# Altium schematic sheet [09] - PERIPHERALS D.SchDoc: Test title
size A4; Date: YYYY-MM-DD; Engineer: X; SheetNumber: 9; Size: A4
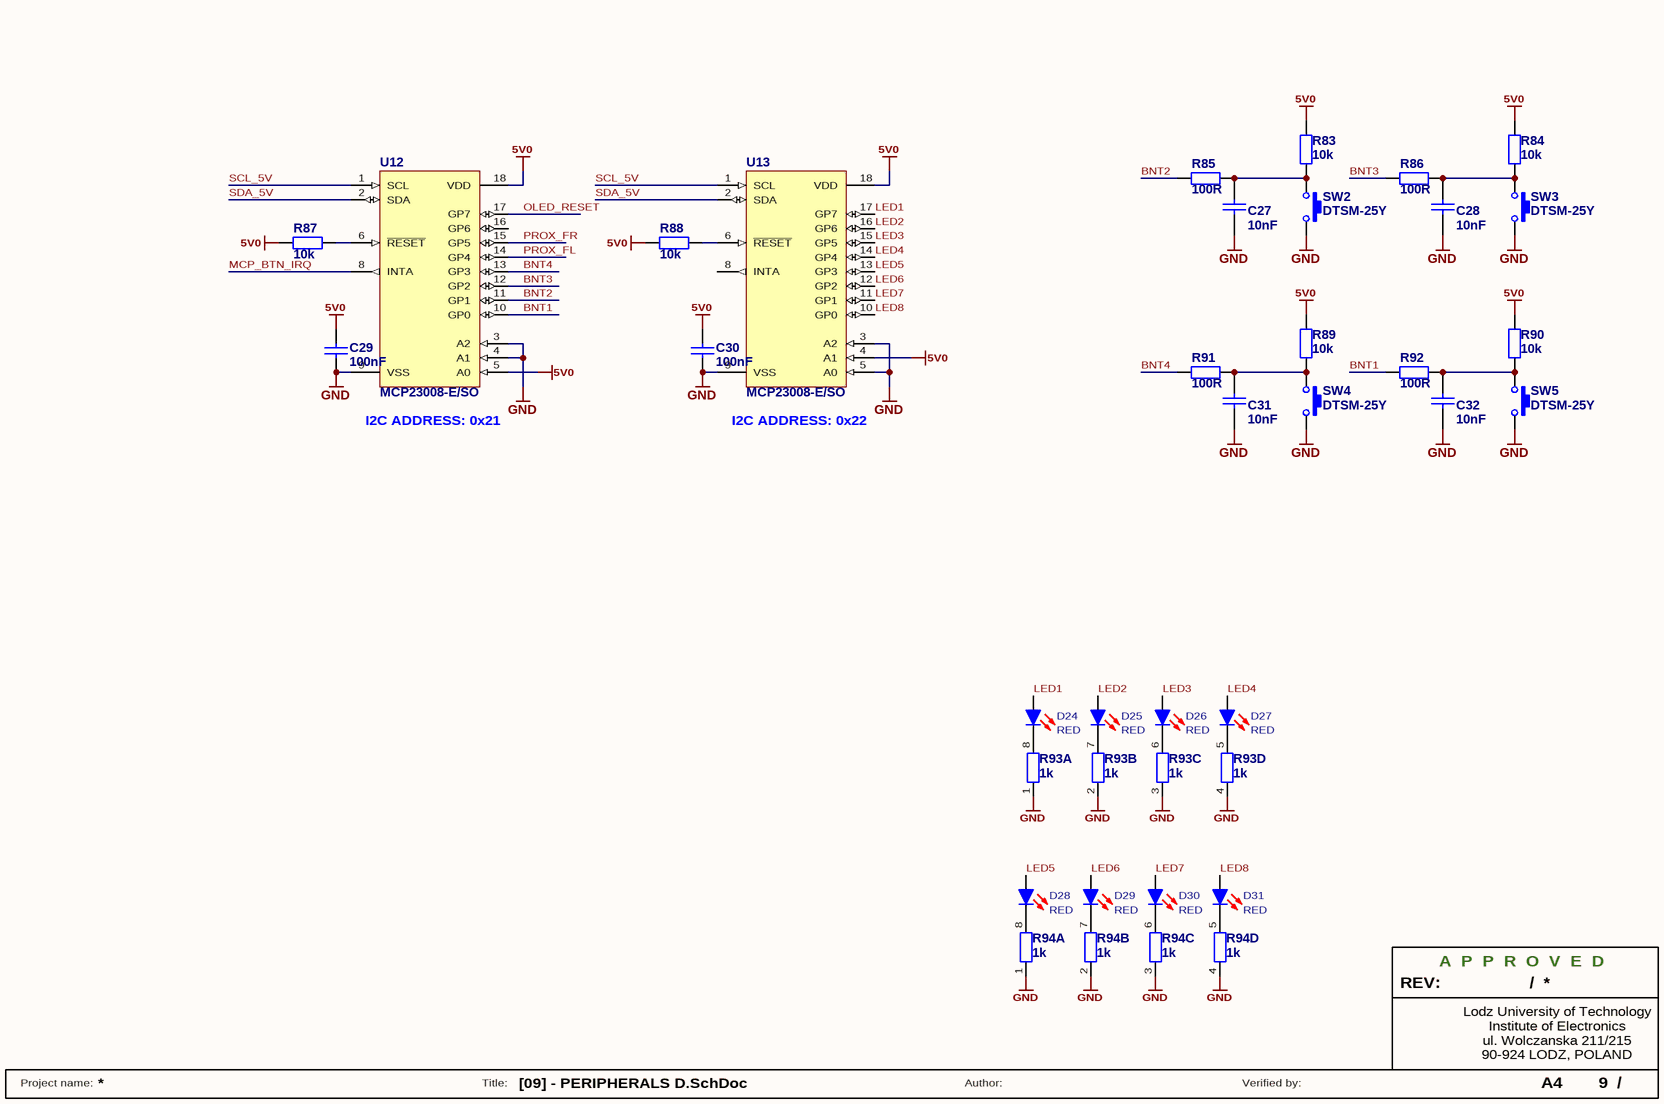
[diagram p0: [09] - PERIPHERALS D.SchDoc]

## Parts
C27  10nF  [C0805]
C28  10nF  [C0805]
C29  100nF  [C0805]
C30  100nF  [C0805]
C31  10nF  [C0805]
C32  10nF  [C0805]
D24  RED  [LED0805R]
D25  RED  [LED0805R]
D26  RED  [LED0805R]
D27  RED  [LED0805R]
D28  RED  [LED0805R]
D29  RED  [LED0805R]
D30  RED  [LED0805R]
D31  RED  [LED0805R]
R83  10k  [R0805]
R84  10k  [R0805]
R85  100R  [R0805]
R86  100R  [R0805]
R87  10k  [R0805]
R88  10k  [R0805]
R89  10k  [R0805]
R90  10k  [R0805]
R91  100R  [R0805]
R92  100R  [R0805]
R93  1k  [RPack_0603x4_1206]  (parts A,B,C,D of 4)
R94  1k  [RPack_0603x4_1206]  (parts A,B,C,D of 4)
SW2  DTSM-25Y  [DTSM-25Y]
SW3  DTSM-25Y  [DTSM-25Y]
SW4  DTSM-25Y  [DTSM-25Y]
SW5  DTSM-25Y  [DTSM-25Y]
U12  MCP23008-E/SO  [SO18W]
U13  MCP23008-E/SO  [SO18W]

## Nets
5V0: C29.2 C30.2 R83.2 R84.2 R87.1 R88.1 R89.2 R90.2 U12.5(A0) U12.18(VDD) U13.4(A1) U13.18(VDD)
GND: C27.1 C28.1 C29.1 C30.1 C31.1 C32.1 R93.1 R93.2 R93.3 R93.4 R94.1 R94.2 R94.3 R94.4 SW2.2 SW3.2 SW4.2 SW5.2 U12.3(A2) U12.4(A1) U12.9(VSS) U13.3(A2) U13.5(A0) U13.9(VSS)
BNT1: R92.1 U12.10(GP0)
BNT2: R85.1 U12.11(GP1)
BNT3: R86.1 U12.12(GP2)
BNT4: R91.1 U12.13(GP3)
LED1: D24.1(A) U13.17(GP7)
LED2: D25.1(A) U13.16(GP6)
LED3: D26.1(A) U13.15(GP5)
LED4: D27.1(A) U13.14(GP4)
LED5: D28.1(A) U13.13(GP3)
LED6: D29.1(A) U13.12(GP2)
LED7: D30.1(A) U13.11(GP1)
LED8: D31.1(A) U13.10(GP0)
MCP_BTN_IRQ: U12.8(INTA)
OLED_RESET: U12.17(GP7)
PROX_FL: U12.14(GP4)
PROX_FR: U12.15(GP5)
SCL_5V: U12.1(SCL) U13.1(SCL)
SDA_5V: U12.2(SDA) U13.2(SDA)
NetC27_2: C27.2 R83.1 R85.2 SW2.1
NetC28_2: C28.2 R84.1 R86.2 SW3.1
NetC31_2: C31.2 R89.1 R91.2 SW4.1
NetC32_2: C32.2 R90.1 R92.2 SW5.1
NetD24_2: D24.2(K) R93.8
NetD25_2: D25.2(K) R93.7
NetD26_2: D26.2(K) R93.6
NetD27_2: D27.2(K) R93.5
NetD28_2: D28.2(K) R94.8
NetD29_2: D29.2(K) R94.7
NetD30_2: D30.2(K) R94.6
NetD31_2: D31.2(K) R94.5
NetR87_2: R87.2 U12.6(~{RESET})
NetR88_2: R88.2 U13.6(~{RESET})

Not connected (* = marked no-connect by the designer): U12 16(GP6); U13 8(INTA)

## Notes on the sheet
- I2C ADDRESS: 0x21
- I2C ADDRESS: 0x22
- REV:
- A  P  P  R  O  V  E  D
- /
- Lodz University of Technology
- ul. Wolczanska 211/215
- 90-924 LODZ, POLAND
- Institute of Electronics
- Project name:
- Title:
- Author:
- Verified by:

## Library data of the parts
C27-C32 = Cap: Capacitor; ComponentLink1Description: datasheet; ComponentLink2Description: supplier
  C27 C28 C31 C32: Value: 10nF
  C29 C30: Value: 100nF
D24-D31 = LED_RED: RED LED; Published: 04-Apr-2006
R83-R92 = Res: Resistor; Published: 19-Feb-2006; ComponentLink1Description: datasheet; ComponentLink2Description: supplier
  R83 R84 R87-R90: Value: 10k
  R85 R86 R91 R92: Value: 100R
R93 R94 = Res Pack4_1: Isolated Resistor Network - Parts; Sim Note: Enter the Resistance value into parameter field.; Published: 24-Mar-1999; LatestRevisionDate: 17-Jul-2002; LatestRevisionNote: Re-released for DXP Platform.; PackageReference: DIP-16; Publisher: Altium Limited; Code_JEDEC: MO-001-AC; Value: 1k
SW2-SW5 = DTSM-25Y: DIPTRONICS Yellow 12x12mm SMD Tactile SPST-NO Switch; Supplier 1: TME; Supplier Part Number 1: DTSM-25Y-V-B
U12 U13 = MCP23008-E/SO: 8-Bit I/O Expander with Serial Interface I2C, 18-Pin SOIC Package